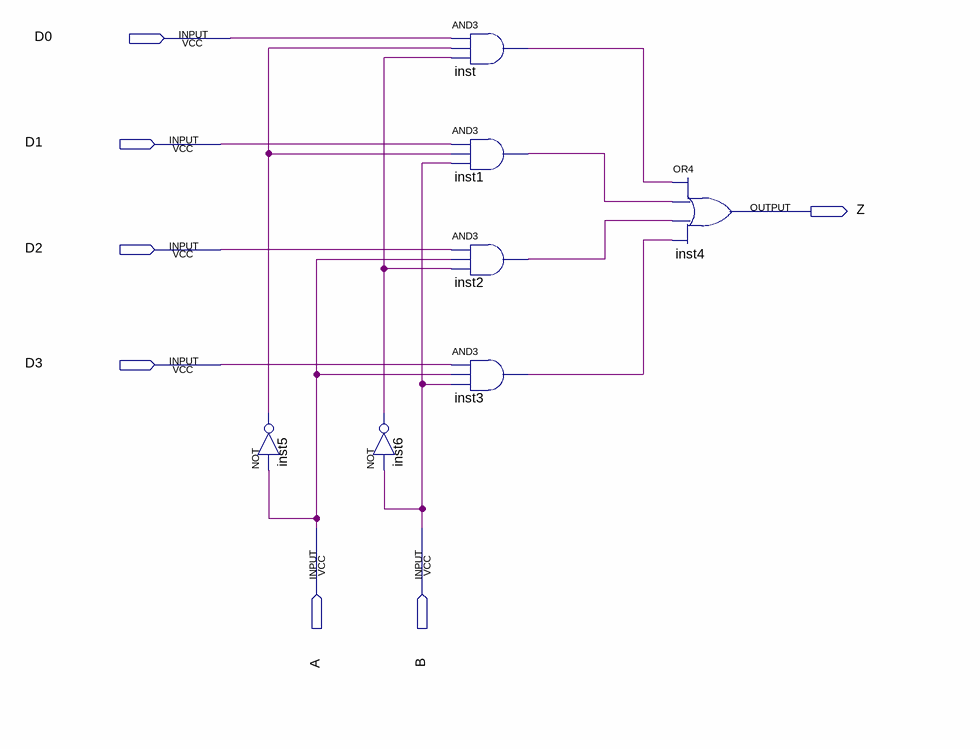
[diagram p0: schematic sheet]
// Quartus schematic Multiplexer421.bdf as structural Verilog: 7 symbols, 7 pins
module Multiplexer421 (
  input  D0,
  input  D1,
  input  D2,
  input  D3,
  input  A,
  input  B,
  output Z
);

  wire inst1_out, inst2_out, inst3_out, inst5_out, inst6_out, inst_out;

  not inst5 (inst5_out, A);
  not inst6 (inst6_out, B);
  and inst (inst_out, D0, inst5_out, inst6_out);
  and inst1 (inst1_out, D1, inst5_out, B);
  and inst2 (inst2_out, D2, A, inst6_out);
  and inst3 (inst3_out, D3, A, B);
  or inst4 (Z, inst_out, inst1_out, inst2_out, inst3_out);
endmodule
